# Altium schematic sheet P05_ Debugger.SchDoc
size A4; SheetNumber: 5; SheetTotal: 7
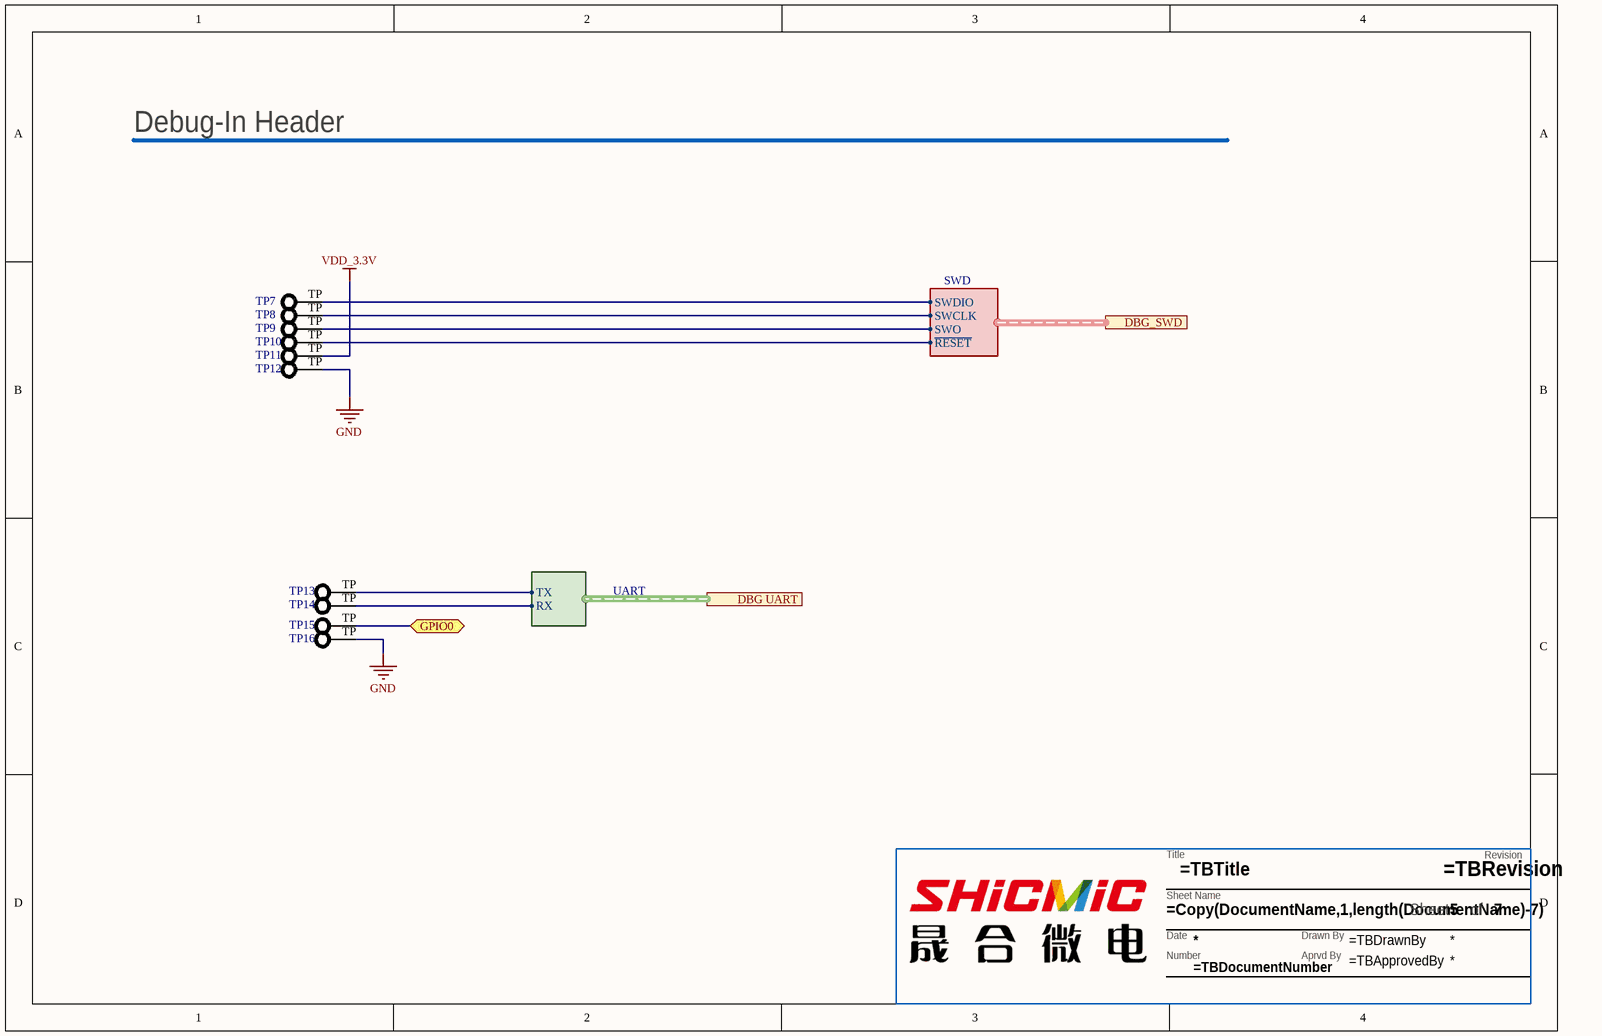
[diagram p0: P05_ Debugger.SchDoc]

## Parts
??  TitleBlock  (value not drawn)  (graphical)
TP7  PAD  [TPPAD_1.0mm]  (value not drawn)  (no BOM)
TP8  PAD  [TPPAD_1.0mm]  (value not drawn)  (no BOM)
TP9  PAD  [TPPAD_1.0mm]  (value not drawn)  (no BOM)
TP10  PAD  [TPPAD_1.0mm]  (value not drawn)  (no BOM)
TP11  PAD  [TPPAD_1.0mm]  (value not drawn)  (no BOM)
TP12  PAD  [TPPAD_1.0mm]  (value not drawn)  (no BOM)
TP13  PAD  [TPPAD_1.0mm]  (value not drawn)  (no BOM)
TP14  PAD  [TPPAD_1.0mm]  (value not drawn)  (no BOM)
TP15  PAD  [TPPAD_1.0mm]  (value not drawn)  (no BOM)
TP16  PAD  [TPPAD_1.0mm]  (value not drawn)  (no BOM)

## Ports
DBG UART (harness UART), DBG_SWD (harness SWD), GPIO0 (bidir)

## Harnesses
SWD: SWCLK, SWDIO, SWO, ~{RESET}
UART: TX, RX

## Nets
GND: TP12.TP TP16.TP
VDD_3.3V: TP11.TP
GPIO0: TP15.TP ; port GPIO0
NetTP7_TP: TP7.TP ; port DBG_SWD.SWDIO
NetTP8_TP: TP8.TP ; port DBG_SWD.SWCLK
NetTP9_TP: TP9.TP ; port DBG_SWD.SWO
NetTP10_TP: TP10.TP ; port DBG_SWD.~{RESET}
NetTP13_TP: TP13.TP ; port DBG UART.TX
NetTP14_TP: TP14.TP ; port DBG UART.RX

## Notes on the sheet
- Debug-In Header
- (in symbol TitleBlock) Revision; Title; Sheet Name; Sheet; of; Date; Drawn By; Number; Aprvd By

## Library data of the parts
?? = TitleBlock: Title block for Ambiq Schematics. Please have the following parameters entered in Project>Project Options>Parameters: / TBTitle / TBDocumentNumber / TBRevision / TBDrawnBy / TBApprovedBy; AMBIQ PN: TitleBlock
TP7-TP16 = TP_PAD: None; AMBIQ PN: TP_PAD